# EAGLE schematic YogiBear (EAGLE 7.6.0)
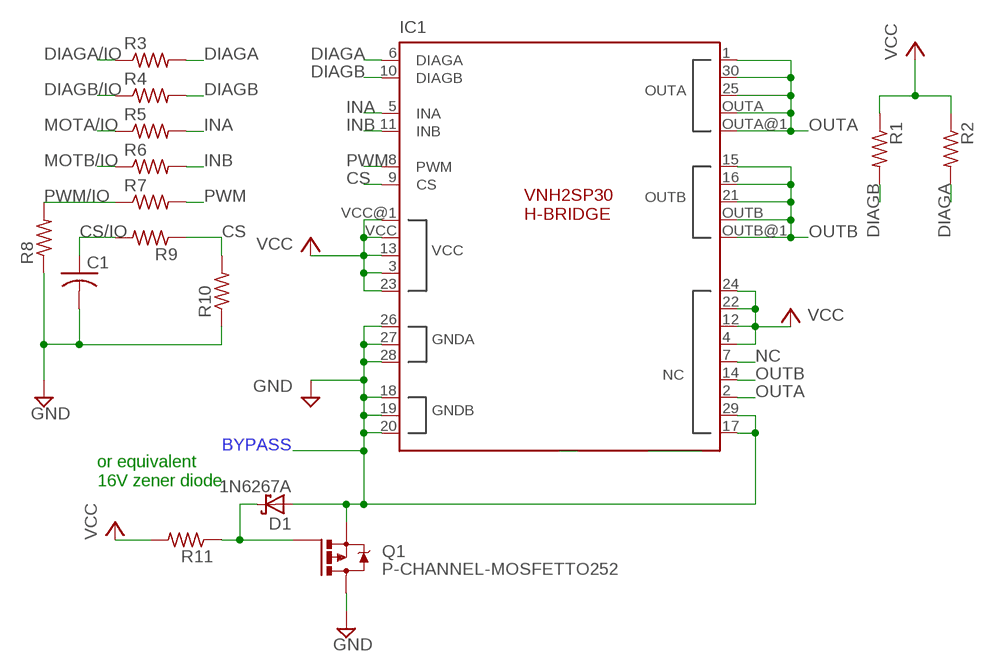
[diagram p0: schematic, sheet 1]

## Parts
C1  C-US025-024X044  [C025-024X044]
D1  1N6267A  [C4111-15]
IC1  VNH2SP30  [VNH2SP30]
Q1  P-CHANNEL-MOSFETTO252  [TO252]
R1  R-US_R0603  [R0603]
R2  R-US_R0603  [R0603]
R3  R-US_R0603  [R0603]
R4  R-US_R0603  [R0603]
R5  R-US_R0603  [R0603]
R6  R-US_R0603  [R0603]
R7  R-US_R0603  [R0603]
R8  R-US_R0603  [R0603]
R9  R-US_R0603  [R0603]
R10  R-US_R0603  [R0603]
R11  R-US_R0603  [R0603]

## Nets
CS: IC1.9(CS) R9.1 R10.2
CS/IO: C1.1 R9.2
DIAGA: IC1.6(DIAGA) R2.2 R3.2
DIAGA/IO: R3.1
DIAGB: IC1.10(DIAGB) R1.2 R4.2
DIAGB/IO: R4.1
GND: C1.2 D1.A IC1.17(NC) IC1.18(GNDB) IC1.19(GNDB) IC1.20(GNDB) IC1.26(GNDA) IC1.27(GNDA) IC1.28(GNDA) IC1.29(NC1) Q1.2(S) Q1.3(D) R8.1 R10.1
INA: IC1.5(INA) R5.2
INB: IC1.11(INB) R6.2
MOTA/IO: R5.1
MOTB/IO: R6.1
N$2: D1.C Q1.1(G) R11.1
NC: IC1.7(NC4)
OUTA: IC1.1(OUTA) IC1.2(NC2) IC1.25(OUTA) IC1.30(OUTA) IC1.OUTA IC1.OUTA@1(OUTA)
OUTB: IC1.14(NC3) IC1.15(OUTB) IC1.16(OUTB) IC1.21(OUTB) IC1.OUTB IC1.OUTB@1(OUTB)
PWM: IC1.8(PWM) R7.2
PWM/IO: R7.1 R8.2
VCC: IC1.3(VCC) IC1.13(VCC) IC1.23(VCC) IC1.VCC IC1.VCC@1(VCC) R1.1 R2.1 R11.2
VIN: IC1.4(NC5) IC1.12(NC6) IC1.22(NC7) IC1.24(NC8) ; supply symbol labelled VCC

## Notes on the sheet
- BYPASS
- or equivalent
  16V zener diode

## Library data of the parts
C1 = adafruit:C-US: CAPACITOR, American symbol
D1 = diode:1N6267A: DIODE transient voltage suppressor
IC1 = pie:VNH2SP30: FULLY INTEGRATED H-BRIDGE MOTOR DRIVER Source: http://pdf1.alldatasheet.com/datasheet-pdf/view/84563/STMICROELECTRONICS/VNH3SP30.html Modified to match the pinout of VNH2SP30 by adding a CS pin to pin 9.; MPN: VNH3SP30-E; OC_FARNELL: 1739420; OC_NEWARK: 33R1486
Q1 = pie:P-CHANNEL-MOSFET: P-Channel PowerTrench® MOSFET Source: FDD4141.pdf; PIE-DIGIKEY-PN-PRI: IPD90P03P4L-04INCT-ND; PIE-INT-REF-NUM: PMOS
R1-R11 = adafruit:R-US_: RESISTOR, American symbol